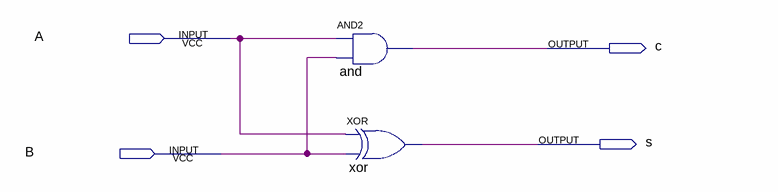
[diagram p0: schematic sheet]
// Quartus schematic halfadder.bdf as structural Verilog: 2 symbols, 4 pins
module halfadder (
  input  A,
  input  B,
  output c,
  output s
);

  and \and  (c, A, B);
  xor \xor  (s, A, B);
endmodule
